# EAGLE design AT28C256_zif (EAGLE 7.1.0)
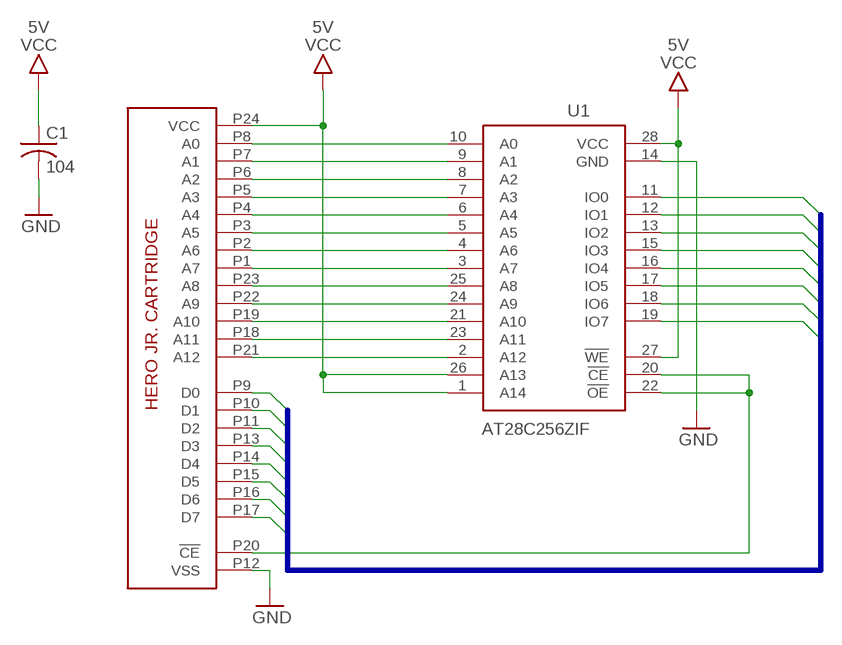
[diagram p0: schematic, sheet 1]

## Parts
C1  104  C-US050-025X075  [C050-025X075]
U1  AT28C256ZIF  [DIL28-ZIF]
U$1  HEROJRCART  [HEROJRCART]

## Nets
!CE: U1.20(!CE) U1.22(!OE) U$1.P20(!CE)
A0: U1.10(A0) U$1.P8(A0)
A1: U1.9(A1) U$1.P7(A1)
A2: U1.8(A2) U$1.P6(A2)
A3: U1.7(A3) U$1.P5(A3)
A4: U1.6(A4) U$1.P4(A4)
A5: U1.5(A5) U$1.P3(A5)
A6: U1.4(A6) U$1.P2(A6)
A7: U1.3(A7) U$1.P1(A7)
A8: U1.25(A8) U$1.P23(A8)
A9: U1.24(A9) U$1.P22(A9)
A10: U1.21(A10) U$1.P19(A10)
A11: U1.23(A11) U$1.P18(A11)
A12: U1.2(A12) U$1.P21(A12)
D0: U1.11(IO0) U$1.P9(D0)
D1: U1.12(IO1) U$1.P10(D1)
D2: U1.13(IO2) U$1.P11(D2)
D3: U1.15(IO3) U$1.P13(D3)
D4: U1.16(IO4) U$1.P14(D4)
D5: U1.17(IO5) U$1.P15(D5)
D6: U1.18(IO6) U$1.P16(D6)
D7: U1.19(IO7) U$1.P17(D7)
GND: C1.2 U1.14(GND) U$1.P12(VSS)
VCC: C1.1 U1.1(A14) U1.26(A13) U1.27(!WE) U1.28(VCC) U$1.P24(VCC) ; supply symbol labelled 5V

## Buses
B$1

## Library data of the parts
C1 = rcl:C-US: CAPACITOR, American symbol
U1 = bt_memory:AT28C256: EEPROM 32Kx8 256k bit The AT28C256 is a high-performance Electrically Erasable and Programmable Read Only Memory. Its 256K of memory is organized as 32,768 words by 8 bits.
U$1 = bt:HEROJRCART: Hero Jr. Cartridge (ROM)

## Board
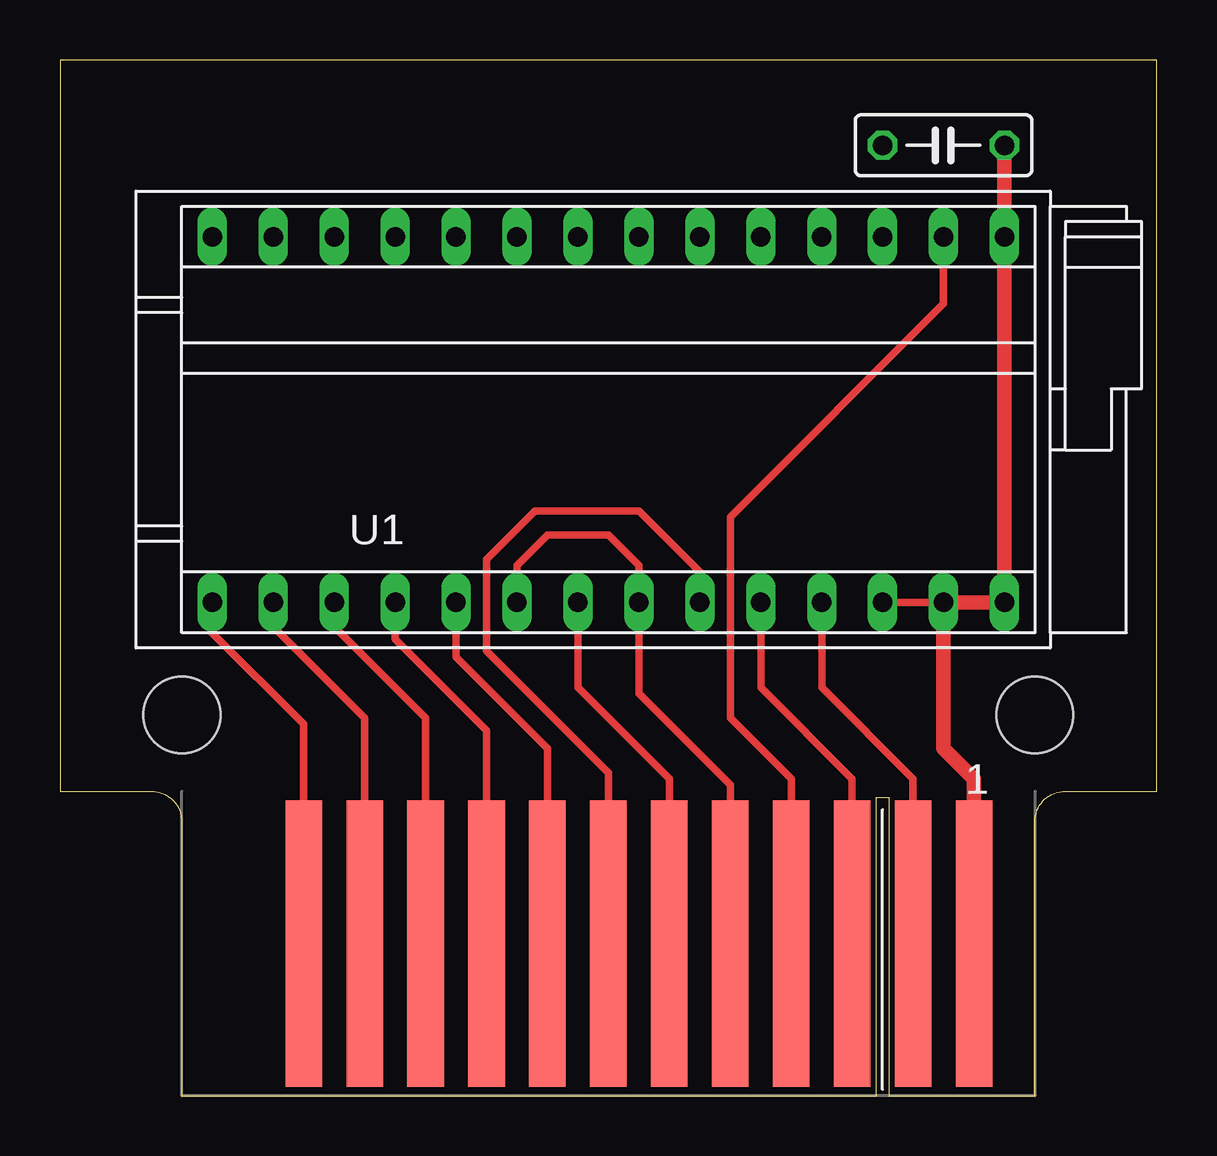
[diagram p1: board, top side]
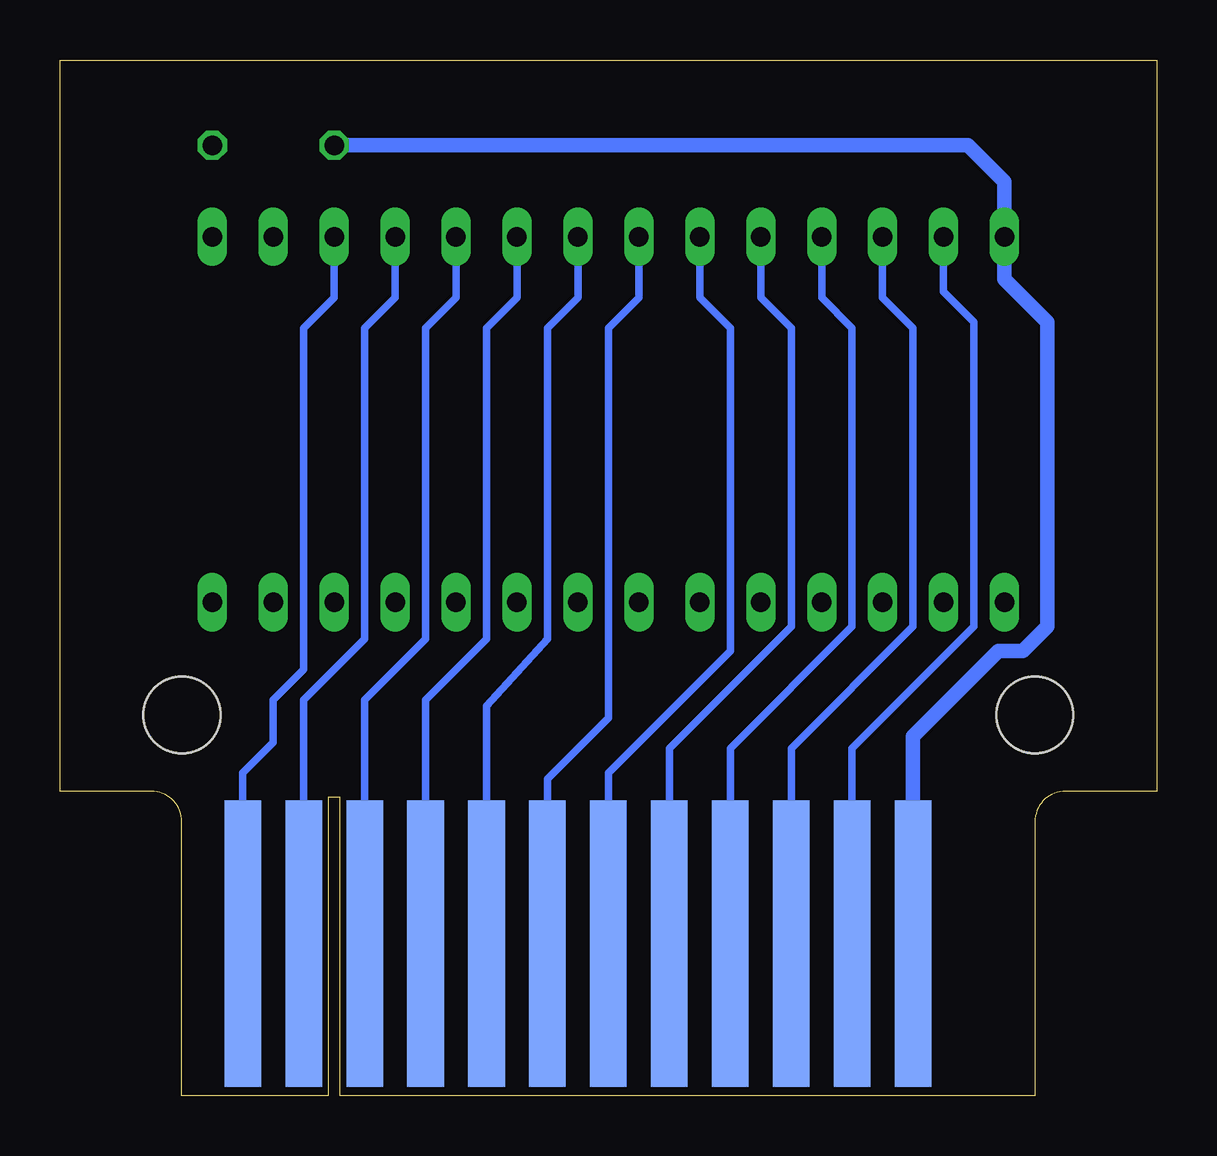
[diagram p2: board, bottom side, seen from below]

Size 45.72 x 43.18 mm. Coordinates in mm from the lower left corner, seen from the top.
Outline: 5.08,0 34.04,0 34.04,12.45 34.54,12.45 34.54,0 40.64,0 40.64,11.43 arc-90 41.91,12.7 45.72,12.7 45.72,43.18 0,43.18 0,12.7 3.81,12.7 arc-90 5.08,11.43 5.08,0
Copper layers (1*16): Top 0.0356mm / dielectric 1.5011mm / Bottom 0.0356mm
Design rules "LaenPCBOrder": minimum track width 6mil, minimum drill 13mil, track to track 10mil, track to pad 10mil, pad to pad 10mil, via to via 10mil, smd to smd 8mil, copper to edge 10mil, drill to drill 10mil, minimum pad ring 7mil, minimum via ring 7mil, stop-mask expansion 3mil, vias tented up to drill 20mil, thermal gap 10mil
Holes 3.2 mm at 5.08,15.88 40.64,15.88

### Footprints (pad centres in the part's own frame; a part is rotated, then mirrored left to right if it is on the bottom)
C050-025X075 = drill 0.813 octagon: 1 -2.54,0; 2 2.54,0
DIL28-ZIF = drill 0.813 long: 1 -16.51,-7.62; 2 -13.97,-7.62; 3 -11.43,-7.62; 4 -8.89,-7.62; 5 -6.35,-7.62; 6 -3.81,-7.62; 7 -1.27,-7.62; 8 1.27,-7.62; 9 3.81,-7.62; 10 6.35,-7.62; 11 8.89,-7.62; 12 11.43,-7.62; 13 13.97,-7.62; 14 16.51,-7.62; 15 16.51,7.62; 16 13.97,7.62; 17 11.43,7.62; 18 8.89,7.62; 19 6.35,7.62; 20 3.81,7.62; 21 1.27,7.62; 22 -1.27,7.62; 23 -3.81,7.62; 24 -6.35,7.62; 25 -8.89,7.62; 26 -11.43,7.62; 27 -13.97,7.62; 28 -16.51,7.62
HEROJRCART = smd 1.524 x 11.938 bottom: P1 15.24,0.254; P2 12.7,0.254; P3 10.16,0.254; P4 7.62,0.254; P5 5.08,0.254; P6 2.54,0.254; P7 0,0.254; P8 -2.54,0.254; P9 -5.08,0.254; P10 -7.62,0.254; P11 -10.16,0.254; P12 -12.7,0.254 | smd 1.524 x 11.938: P13 -12.7,0.254; P14 -10.16,0.254; P15 -7.62,0.254; P16 -5.08,0.254; P17 -2.54,0.254; P18 0,0.254; P19 2.54,0.254; P20 5.08,0.254; P21 7.62,0.254; P22 10.16,0.254; P23 12.7,0.254; P24 15.24,0.254

### Placement (x,y rotation side)
C1  36.83,39.62 180 top
U1  22.86,28.19 180 top
U$1  22.86,6.1 0 top

### Tracks (layer width: path | path; a pad name or v marks a point on that pad's centre or on a via)
!CE
  Top 0.305: U$1.P20 27.94,12.95 24.13,16.76 U1.22 24.13,22.1 22.86,23.37 20.32,23.37 19.05,22.1 U1.20
A0
  Bottom 0.305: U$1.P8 20.32,14.48 15.24,19.56 15.24,32 16.51,33.27 U1.10
A1
  Bottom 0.305: U$1.P7 22.86,13.46 17.78,18.54 17.78,32 19.05,33.27 U1.9
A2
  Bottom 0.305: U1.8 21.59,33.27 22.86,32 22.86,15.75 25.4,13.21 U$1.P6
A3
  Bottom 0.305: U$1.P5 27.94,16.26 25.4,19.05 25.4,32 24.13,33.27 U1.7
A4
  Bottom 0.305: U$1.P4 30.48,16.51 27.94,19.05 27.94,32 26.67,33.27 U1.6
A5
  Bottom 0.305: U1.5 29.21,33.27 30.48,32 30.48,19.05 33.02,16.51 U$1.P3
A6
  Bottom 0.305: U$1.P2 35.56,16.51 33.02,19.05 33.02,32 31.75,33.27 U1.4
A7
  Bottom 0.305: U$1.P1 38.1,13.46 36.83,14.73 36.83,16.51 35.56,17.78 35.56,32 34.29,33.27 U1.3
A8
  Top 0.305: U$1.P23 35.56,13.21 31.75,17.02 U1.25
A9
  Top 0.305: U$1.P22 33.02,13.21 29.21,17.02 U1.24
A10
  Top 0.305: U1.21 21.59,17.02 25.4,13.21 U$1.P19
A11
  Top 0.305: U$1.P18 22.86,13.46 17.78,18.54 17.78,22.35 19.81,24.38 24.13,24.38 26.67,21.84 U1.23
A12
  Top 0.305: U$1.P21 30.48,13.21 27.94,15.75 27.94,24.13 36.83,33.02 U1.2
D0
  Bottom 0.305: U$1.P9 17.78,14.48 12.7,19.56 12.7,32 13.97,33.27 U1.11
D1
  Bottom 0.305: U$1.P10 15.24,14.48 10.16,19.56 10.16,32 11.43,33.27 U1.12
D2
  Bottom 0.305: U$1.P11 12.7,14.48 7.62,19.56 7.62,32.26 8.89,33.53 U1.13
D3
  Top 0.305: U$1.P13 10.16,15.49 6.35,19.3 U1.15
D4
  Top 0.305: U$1.P14 12.7,15.75 8.89,19.56 U1.16
D5
  Top 0.305: U$1.P15 15.24,15.75 11.43,19.56 U1.17
D6
  Top 0.305: U$1.P16 17.78,15.24 13.97,19.05 U1.18
D7
  Top 0.305: U$1.P17 20.32,14.48 16.51,18.29 U1.19
GND
  Bottom 0.61: U$1.P12 10.16,14.99 6.6,18.54 5.59,18.54 4.57,19.56 4.57,32.26 6.35,34.04 U1.14 6.35,38.1 7.87,39.62 C1.2
VCC
  Top 0.305: U1.26 U1.27
  Top 0.61: C1.1 U1.1 U1.28 U1.27 36.83,14.48 38.1,13.21 U$1.P24